# EAGLE design motorboard (EAGLE 8.1.0)
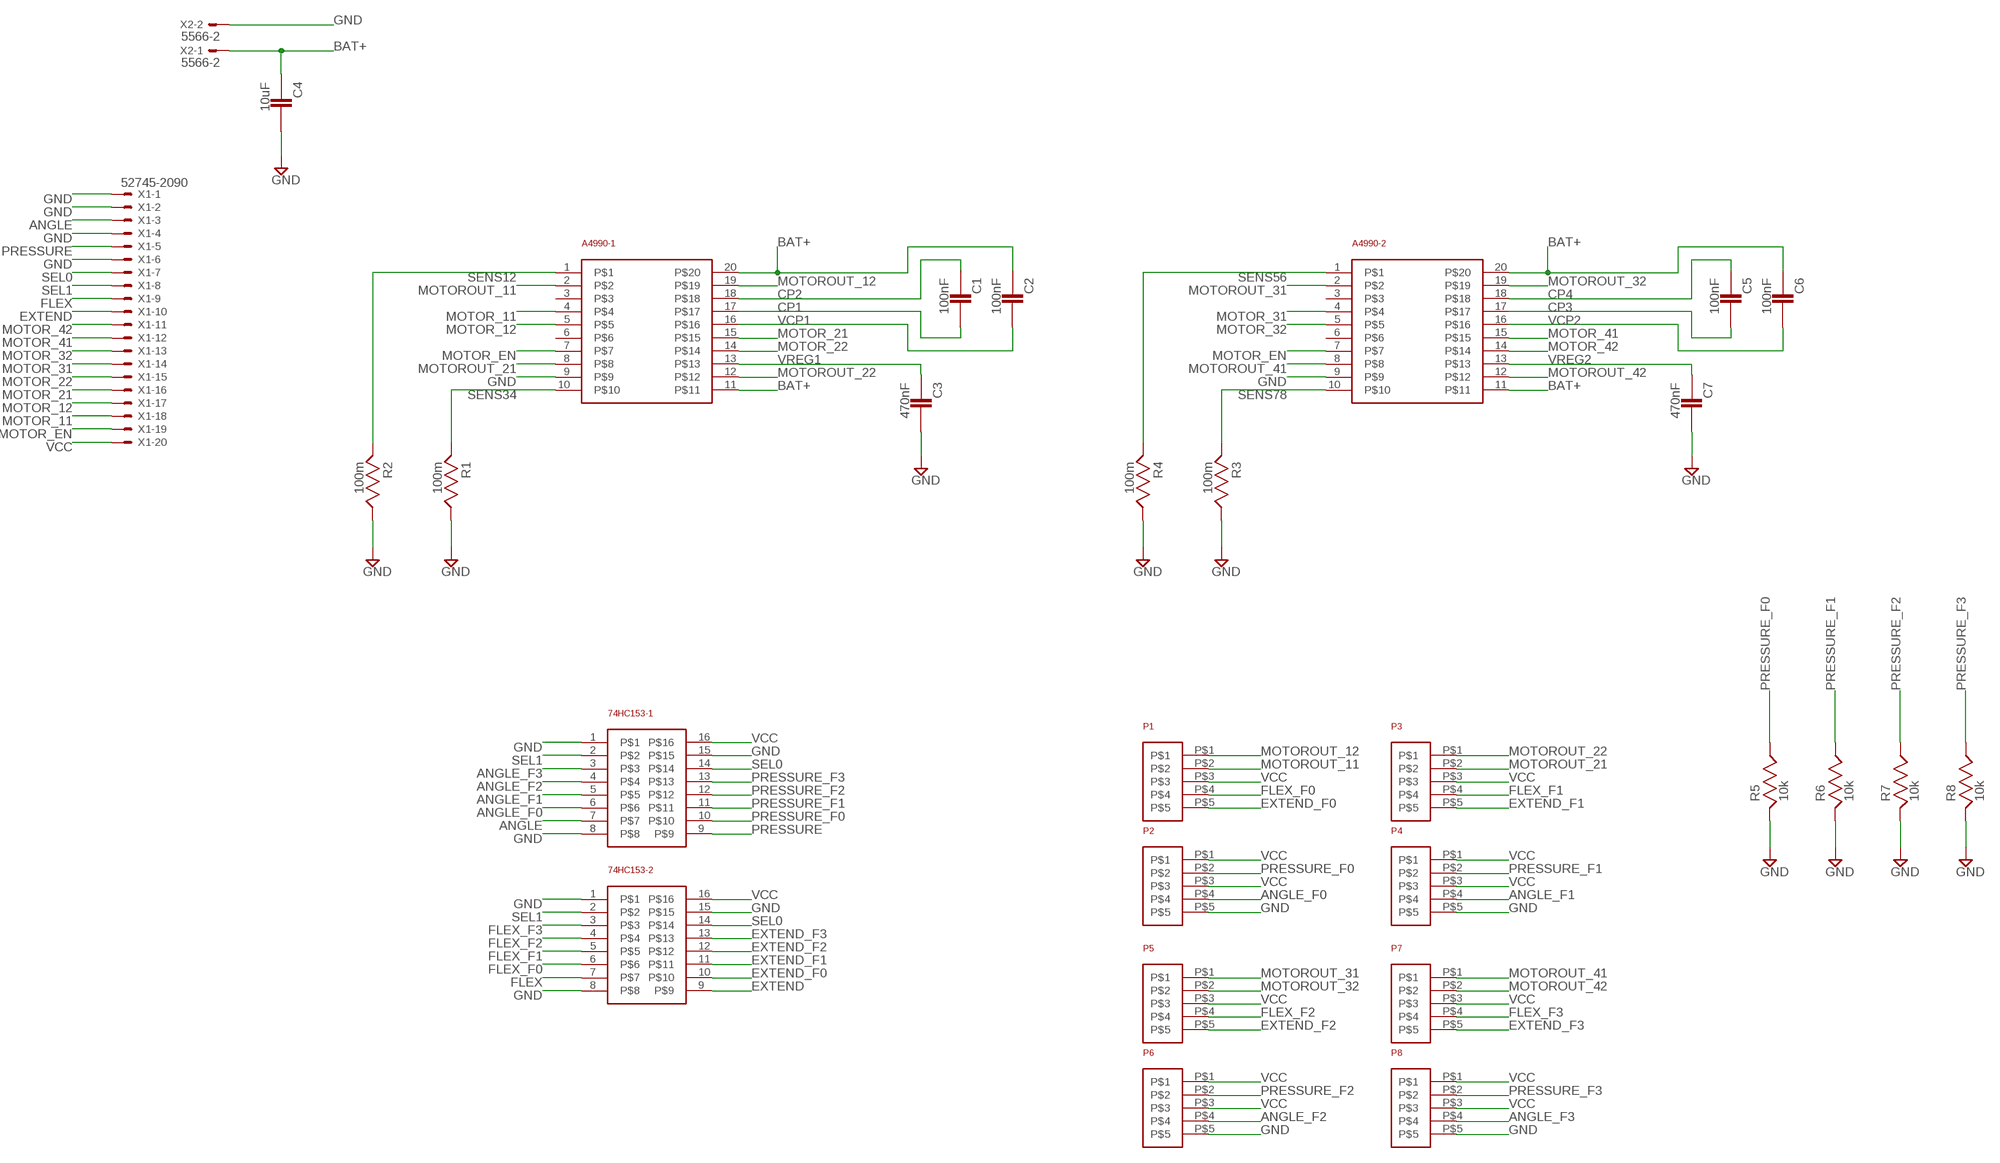
[diagram p0: schematic, sheet 1]

## Parts
74HC153-1  74HC153  [SO-16_S-M]
74HC153-2  74HC153  [SO-16_S-M]
A4990-1  A4990  [A4990]
A4990-2  A4990  [A4990]
C1  100nF  CC0603KRX7R9BB104  [CC0603KRX7R9BB104_CAPC1608X90]
C2  100nF  CC0603KRX7R9BB104  [CC0603KRX7R9BB104_CAPC1608X90]
C3  470nF  CC0603KRX7R9BB104  [CC0603KRX7R9BB104_CAPC1608X90]
C4  10uF  CC0603KRX7R9BB104  [CC0603KRX7R9BB104_CAPC1608X90]
C5  100nF  CC0603KRX7R9BB104  [CC0603KRX7R9BB104_CAPC1608X90]
C6  100nF  CC0603KRX7R9BB104  [CC0603KRX7R9BB104_CAPC1608X90]
C7  470nF  CC0603KRX7R9BB104  [CC0603KRX7R9BB104_CAPC1608X90]
P1  S5B-PH-SM4-TB  [S5B-PH-SM4-TB]
P2  S5B-PH-SM4-TB  [S5B-PH-SM4-TB]
P3  S5B-PH-SM4-TB  [S5B-PH-SM4-TB]
P4  S5B-PH-SM4-TB  [S5B-PH-SM4-TB]
P5  S5B-PH-SM4-TB  [S5B-PH-SM4-TB]
P6  S5B-PH-SM4-TB  [S5B-PH-SM4-TB]
P7  S5B-PH-SM4-TB  [S5B-PH-SM4-TB]
P8  S5B-PH-SM4-TB  [S5B-PH-SM4-TB]
R1  100m  CRCW06031K00FKEA  [CRCW06031K00FKEA_RESC1608X55]
R2  100m  CRCW06031K00FKEA  [CRCW06031K00FKEA_RESC1608X55]
R3  100m  CRCW06031K00FKEA  [CRCW06031K00FKEA_RESC1608X55]
R4  100m  CRCW06031K00FKEA  [CRCW06031K00FKEA_RESC1608X55]
R5  10k  CRCW06031K00FKEA  [CRCW06031K00FKEA_RESC1608X55]
R6  10k  CRCW06031K00FKEA  [CRCW06031K00FKEA_RESC1608X55]
R7  10k  CRCW06031K00FKEA  [CRCW06031K00FKEA_RESC1608X55]
R8  10k  CRCW06031K00FKEA  [CRCW06031K00FKEA_RESC1608X55]
X1  52745-2090  [52745-2090]
X2  5566-2  [5566-2]

## Nets
ANGLE: 74HC153-1.7 X1.3
ANGLE_F0: 74HC153-1.6 P2.P$4
ANGLE_F1: 74HC153-1.5 P4.P$4
ANGLE_F2: 74HC153-1.4 P6.P$4
ANGLE_F3: 74HC153-1.3 P8.P$4
BAT+: A4990-1.11 A4990-1.20 A4990-2.11 A4990-2.20 C2.1 C4.1 C6.1 X2.1
CP1: A4990-1.17 C1.2
CP2: A4990-1.18 C1.1
CP3: A4990-2.17 C5.2
CP4: A4990-2.18 C5.1
EXTEND: 74HC153-2.9 X1.10
EXTEND_F0: 74HC153-2.10 P1.P$5
EXTEND_F1: 74HC153-2.11 P3.P$5
EXTEND_F2: 74HC153-2.12 P5.P$5
EXTEND_F3: 74HC153-2.13 P7.P$5
FLEX: 74HC153-2.7 X1.9
FLEX_F0: 74HC153-2.6 P1.P$4
FLEX_F1: 74HC153-2.5 P3.P$4
FLEX_F2: 74HC153-2.4 P5.P$4
FLEX_F3: 74HC153-2.3 P7.P$4
GND: 74HC153-1.1 74HC153-1.8 74HC153-1.15 74HC153-2.1 74HC153-2.8 74HC153-2.15 A4990-1.9 A4990-2.9 C3.2 C4.2 C7.2 P2.P$5 P4.P$5 P6.P$5 P8.P$5 R1.2 R2.2 R3.2 R4.2 R5.1 R6.1 R7.1 R8.1 X1.1 X1.2 X1.4 X1.6 X2.2
MOTOR_11: A4990-1.4 X1.18
MOTOR_12: A4990-1.5 X1.17
MOTOR_21: A4990-1.15 X1.16
MOTOR_22: A4990-1.14 X1.15
MOTOR_31: A4990-2.4 X1.14
MOTOR_32: A4990-2.5 X1.13
MOTOR_41: A4990-2.15 X1.12
MOTOR_42: A4990-2.14 X1.11
MOTOR_EN: A4990-1.7 A4990-2.7 X1.19
MOTOROUT_11: A4990-1.2 P1.P$2
MOTOROUT_12: A4990-1.19 P1.P$1
MOTOROUT_21: A4990-1.8 P3.P$2
MOTOROUT_22: A4990-1.12 P3.P$1
MOTOROUT_31: A4990-2.2 P5.P$1
MOTOROUT_32: A4990-2.19 P5.P$2
MOTOROUT_41: A4990-2.8 P7.P$1
MOTOROUT_42: A4990-2.12 P7.P$2
PRESSURE: 74HC153-1.9 X1.5
PRESSURE_F0: 74HC153-1.10 P2.P$2 R5.2
PRESSURE_F1: 74HC153-1.11 P4.P$2 R6.2
PRESSURE_F2: 74HC153-1.12 P6.P$2 R7.2
PRESSURE_F3: 74HC153-1.13 P8.P$2 R8.2
SEL0: 74HC153-1.14 74HC153-2.14 X1.7
SEL1: 74HC153-1.2 74HC153-2.2 X1.8
SENS12: A4990-1.1 R2.1
SENS34: A4990-1.10 R1.1
SENS56: A4990-2.1 R4.1
SENS78: A4990-2.10 R3.1
VCC: 74HC153-1.16 74HC153-2.16 P1.P$3 P2.P$1 P2.P$3 P3.P$3 P4.P$1 P4.P$3 P5.P$3 P6.P$1 P6.P$3 P7.P$3 P8.P$1 P8.P$3 X1.20
VCP1: A4990-1.16 C2.2
VCP2: A4990-2.16 C6.2
VREG1: A4990-1.13 C3.1
VREG2: A4990-2.13 C7.1
Unconnected: A4990-1.3 A4990-1.6 A4990-2.3 A4990-2.6

## Library data of the parts
74HC153-1 74HC153-2 = hands:74HC153
A4990-1 A4990-2 = hands:A4990
C1-C7 = Common-Parts-Library-Eagle:CC0603KRX7R9BB104: 0603 0.1 uF 50 V ±10 % Tolerance X7R SMT Multilayer Ceramic Capacitor; MANUFACTURER: YAGEO
P1-P8 = hands:S5B-PH-SM4-TB
R1-R8 = Common-Parts-Library-Eagle:CRCW06031K00FKEA: Res Thick Film 0603 1K Ohm 1% 0.1W(1/10W) ?100ppm/C SMD Automotive Paper T/R; MANUFACTURER: VISHAY
X1 = con-molex:52745-2090: FFC/FPC-to-Board 0.50mm (.020") SMT Top Contact Right Angle, ZIF, Style Receptacle 52745 / 52435 Source: http://www.molex.com/product/ffc/52745.html; MF: WALDOM/MOLEX; MPN: 52745-2090; OC_FARNELL: unknown; OC_NEWARK: 38C9891
X2 = con-molex:5566-2: Mini FIT connector 2 pol Source: http://www.molex.com; OC_FARNELL: 1822072; OC_NEWARK: unknown

## Board
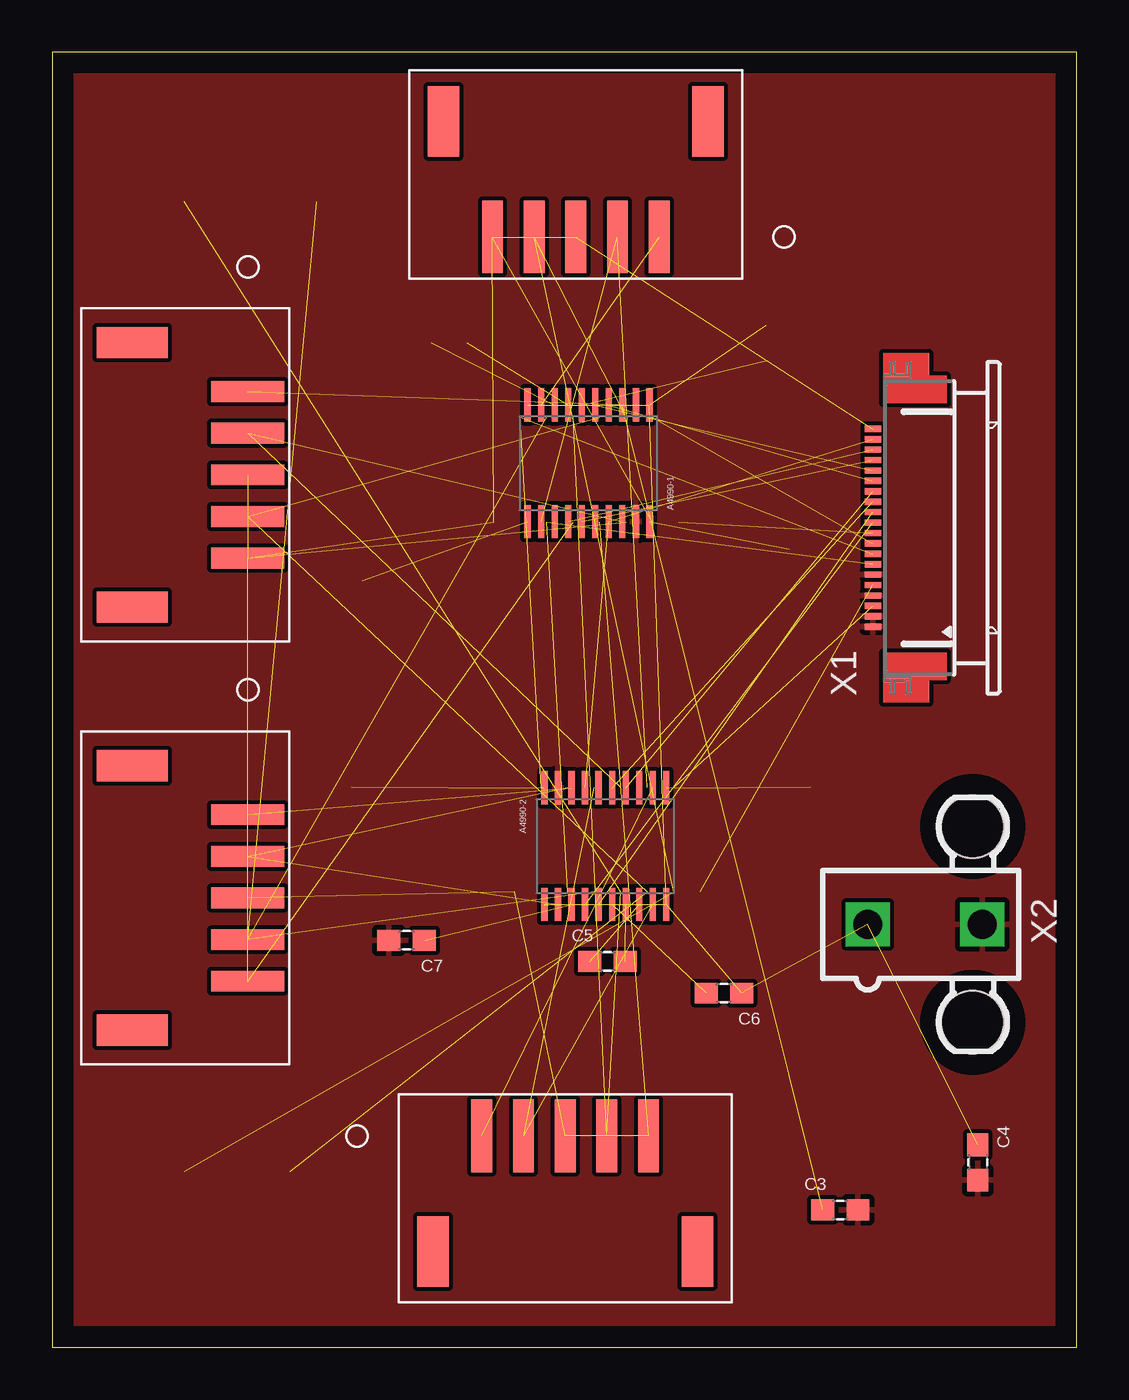
[diagram p1: board, top side]
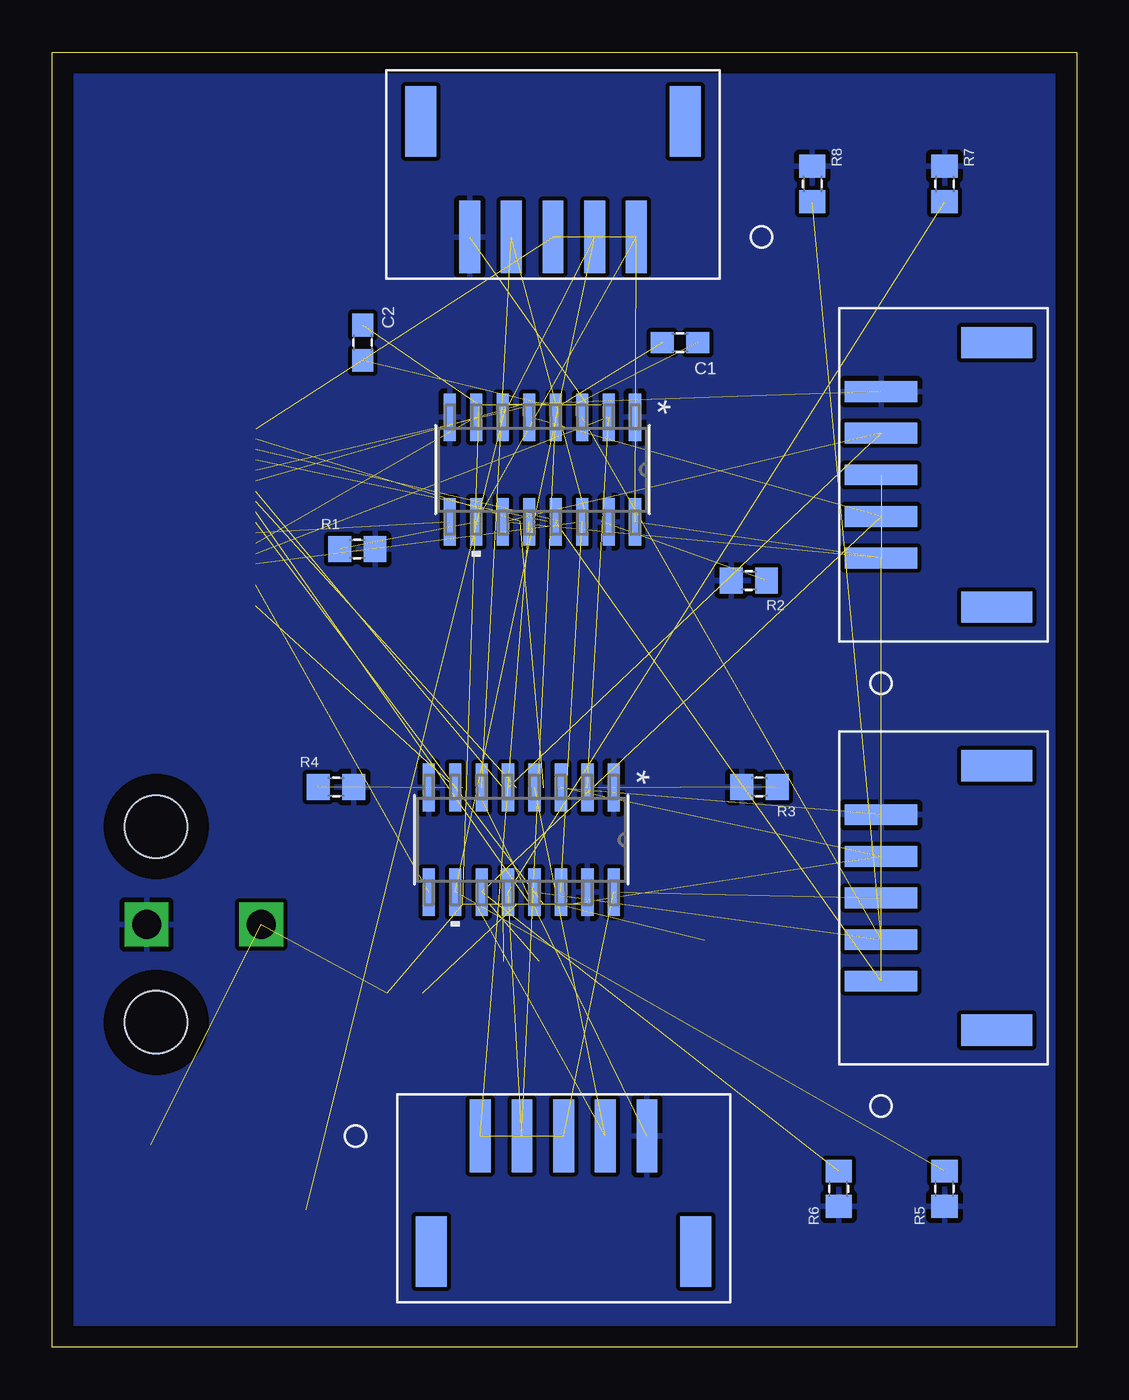
[diagram p2: board, bottom side, seen from below]

Size 49.2 x 62.22 mm. Coordinates in mm from the lower left corner, seen from the top.
Outline: 0,0 49.2,0 49.2,62.22 0,62.22 0,0
Copper layers (1*16): Top 0.035mm / dielectric 1.5mm / Bottom 0.035mm
Design rules "default": minimum track width 10mil, minimum drill 24mil, track to track 8mil, track to pad 8mil, pad to pad 8mil, via to via 8mil, smd to smd 8mil, copper to edge 40mil, drill to drill 8mil, minimum pad ring 10mil, minimum via ring 8mil, stop-mask expansion 4mil, vias tented up to drill 0mil, thermal gap 10mil

### Footprints (pad centres in the part's own frame; a part is rotated, then mirrored left to right if it is on the bottom)
SO-16_S-M = smd 2.286 x 0.584: 1 -2.515,4.445; 2 -2.515,3.175; 3 -2.515,1.905; 4 -2.515,0.635; 5 -2.515,-0.635; 6 -2.515,-1.905; 7 -2.515,-3.175; 8 -2.515,-4.445; 9 2.515,-4.445; 10 2.515,-3.175; 11 2.515,-1.905; 12 2.515,-0.635; 13 2.515,0.635; 14 2.515,1.905; 15 2.515,3.175; 16 2.515,4.445
A4990 = smd 1.6 x 0.3: 1 -2.748,2.822; 2 -2.748,2.172; 3 -2.748,1.522; 4 -2.748,0.872; 5 -2.748,0.222; 6 -2.748,-0.428; 7 -2.748,-1.078; 8 -2.748,-1.728; 9 -2.748,-2.378; 10 -2.748,-3.028; 11 2.853,-3.028; 12 2.853,-2.378; 13 2.853,-1.728; 14 2.853,-1.078; 15 2.853,-0.428; 16 2.853,0.222; 17 2.853,0.872; 18 2.853,1.522; 19 2.853,2.172; 20 2.853,2.822
CC0603KRX7R9BB104_CAPC1608X90 = smd 1.1 x 1: 1 -0.85,0; 2 0.85,0
S5B-PH-SM4-TB = smd 1 x 3.5: P$1 4,0; P$2 2,0; P$3 0,0; P$4 -2,0; P$5 -4,0 | smd 1.5 x 3.4: P$6 6.35,5.55; P$7 -6.35,5.55
CRCW06031K00FKEA_RESC1608X55 = smd 1.1 x 1.25: 1 -0.85,0; 2 0.85,0
52745-2090 = smd 0.3 x 0.8: 1 -4.75,2.5; 2 -4.25,2.5; 3 -3.75,2.5; 4 -3.25,2.5; 5 -2.75,2.5; 6 -2.25,2.5; 7 -1.75,2.5; 8 -1.25,2.5; 9 -0.75,2.5; 10 -0.25,2.5; 11 0.25,2.5; 12 0.75,2.5; 13 1.25,2.5; 14 1.75,2.5; 15 2.25,2.5; 16 2.75,2.5; 17 3.25,2.5; 18 3.75,2.5; 19 4.25,2.5; 20 4.75,2.5
5566-2 = drill 1.4 square: 1 0,-2.75; 2 0,2.75 | hole 3: 4.7,2.29; -4.7,2.29

### Placement (x,y rotation side)
74HC153-1  26.67,24.38 270 bottom
74HC153-2  25.65,42.16 270 bottom
A4990-1  25.65,42.42 90 top
A4990-2  26.67,24.13 270 top
C1  19.05,48.26 180 bottom
C2  34.29,48.26 270 bottom
C3  37.85,6.6 0 top
C4  44.45,8.89 270 top
C5  26.67,18.54 0 top
C6  32.26,17.02 180 top
C7  17.02,19.56 180 top
P1  25.15,53.34 0 top
P2  25.15,53.34 0 bottom
P3  9.4,41.91 90 top
P4  9.4,41.91 270 bottom
P5  24.64,10.16 180 top
P6  24.64,10.16 180 bottom
P7  9.4,21.59 90 top
P8  9.4,21.59 270 bottom
R1  34.54,38.35 0 bottom
R2  15.75,36.83 180 bottom
R3  15.24,26.92 180 bottom
R4  35.56,26.92 0 bottom
R5  6.35,7.62 90 bottom
R6  11.43,7.62 90 bottom
R7  6.35,55.88 270 bottom
R8  12.7,55.88 270 bottom
X1  41.91,39.37 90 top
X2  41.91,20.32 270 top

### Tracks (layer width: path | path; a pad name or v marks a point on that pad's centre or on a via)
ANGLE  (1 unrouted)
ANGLE_F0  (1 unrouted)
ANGLE_F1  (1 unrouted)
ANGLE_F2  (1 unrouted)
ANGLE_F3  (1 unrouted)
BAT+  (7 unrouted)
CP1  (1 unrouted)
CP2  (1 unrouted)
CP3  (1 unrouted)
CP4  (1 unrouted)
EXTEND  (1 unrouted)
EXTEND_F0  (1 unrouted)
EXTEND_F1  (1 unrouted)
EXTEND_F2  (1 unrouted)
EXTEND_F3  (1 unrouted)
FLEX  (1 unrouted)
FLEX_F0  (1 unrouted)
FLEX_F1  (1 unrouted)
FLEX_F2  (1 unrouted)
FLEX_F3  (1 unrouted)
GND
  pour Bottom: -3.56,65.02 52.32,65.02 52.32,-5.08 -3.56,-5.08 -3.56,64.52
  pour Top: -2.54,64.01 51.31,64.01 51.31,-4.06 -2.54,-4.06
MOTOR_11  (1 unrouted)
MOTOR_12  (1 unrouted)
MOTOR_21  (1 unrouted)
MOTOR_22  (1 unrouted)
MOTOR_31  (1 unrouted)
MOTOR_32  (1 unrouted)
MOTOR_41  (1 unrouted)
MOTOR_42  (1 unrouted)
MOTOR_EN  (2 unrouted)
MOTOROUT_11  (1 unrouted)
MOTOROUT_12  (1 unrouted)
MOTOROUT_21  (1 unrouted)
MOTOROUT_22  (1 unrouted)
MOTOROUT_31  (1 unrouted)
MOTOROUT_32  (1 unrouted)
MOTOROUT_41  (1 unrouted)
MOTOROUT_42  (1 unrouted)
PRESSURE  (1 unrouted)
PRESSURE_F0  (2 unrouted)
PRESSURE_F1  (2 unrouted)
PRESSURE_F2  (2 unrouted)
PRESSURE_F3  (2 unrouted)
SEL0  (2 unrouted)
SEL1  (2 unrouted)
SENS12  (1 unrouted)
SENS34  (1 unrouted)
SENS56  (1 unrouted)
SENS78  (1 unrouted)
VCC  (14 unrouted)
VCP1  (1 unrouted)
VCP2  (1 unrouted)
VREG1  (1 unrouted)
VREG2  (1 unrouted)